# EAGLE design Ni-MH-charger-module (EAGLE 8.3.1)
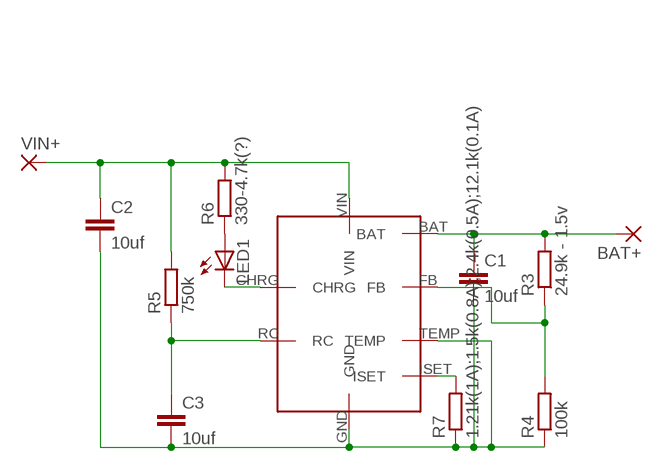
[diagram p0: schematic, sheet 1]

## Parts
BAT+  SMD5  [SMD2,54-5,08]
C1  10uf  C-EUC0805  [C0805]
C2  10uf  C-EUC0805  [C0805]
C3  10uf  C-EUC0805  [C0805]
LED1  LEDCHIPLED_0805  [CHIPLED_0805]
R3  24.9k - 1.5v  R-EU_R0805  [R0805]
R4  100k  R-EU_R0805  [R0805]
R5  750k  R-EU_R0805  [R0805]
R6  330-4.7k(?)  R-EU_R0805  [R0805]
R7  1.21k(1A);1.5k(0.8A);2.4k(0.5A);12.1k(0.1A)  R-EU_R0805  [R0805]
U$1  CN3085  [CN3085]
VIN+  SMD5  [SMD2,54-5,08]

## Nets
BAT+: BAT+.1(P) C1.1 R3.2 U$1.BAT
GND: C1.2 C2.2 C3.2 R4.1 R7.1 U$1.GND U$1.TEMP
N$3: R3.1 R4.2 U$1.FB
N$4: R7.2 U$1.ISET
N$5: C3.1 R5.1 U$1.RC
N$8: LED1.A R6.1
N$9: LED1.C U$1.CHRG
VIN: C2.1 R5.2 R6.2 U$1.VIN VIN+.1(P)

## Library data of the parts
BAT+ VIN+ = wirepad:SMD5: SMD PAD
C1-C3 = resistor:C-EU: CAPACITOR, European symbol
LED1 = adafruit:LED: LED OSRAM: - CHIPLED LG R971, LG N971, LY N971, LG Q971, LY Q971, LO R971, LY R971 LH N974, LH R974 LS Q976, LO Q976, LY Q976 LO Q996 - Hyper CHIPLED LW Q18S LB Q993, LB Q99A, LB R99A - SideLED LS A670, LO A670, LY A670, LG A670, LP A670 LB A673, LV A673, LT A673, LW A673 LH A674 LY A675 LS A676, LA A676, LO A676, LY A676, LW A676 LS A679, LY A679, LG A679 - Hyper Micro SIDELED® LS Y876, LA Y876, LO Y876, LY Y876 LT Y87S - SmartLED LW L88C, LW L88S LB L89C, LB L89S, LG L890 LS L89K, LO L89K, LY L89K LS L896, LA L896, LO L896, LY L896 - TOPLED LS T670, LO T670, LY T670, LG T670, LP T670 LSG T670, LSP T670, LSY T670, LOP T670, LYG T670 LG T671, LOG T671, LSG T671 LB T673, LV T673, LT T673, LW T673 LH T674 LS T676, LA T676, LO T676, LY T676, LB T676, LH T676, LSB T676, LW T676 LB T67C, LV T67C, LT T67C, LS T67K, LO T67K, LY T67K, LW E67C LS E67B, LA E67B, LO E67B, LY E67B, LB E67C, LV E67C, LT E67C LW T67C LS T679, LY T679, LG T679 LS T770, LO T770, LY T770, LG T770, LP T770 LB T773, LV T773, LT T773, LW T773 LH T774 LS E675, LA E675, LY E675, LS T675 LS T776, LA T776, LO T776, LY T776, LB T776 LHGB T686 LT T68C, LB T68C - Hyper Mini TOPLED® LB M676 - Mini TOPLED Santana® LG M470 LS M47K, LO M47K, LY M47K Source: http://www.osram.convergy.de/
R3-R7 = resistor:R-EU_: RESISTOR, European symbol
U$1 = mgvc:CN3085: 1A Nickel-Metal Hydride Battery Charger IC Контроллер заряда Ni-MH аккумуляторов. Максимальный ток до 1A.

## Board
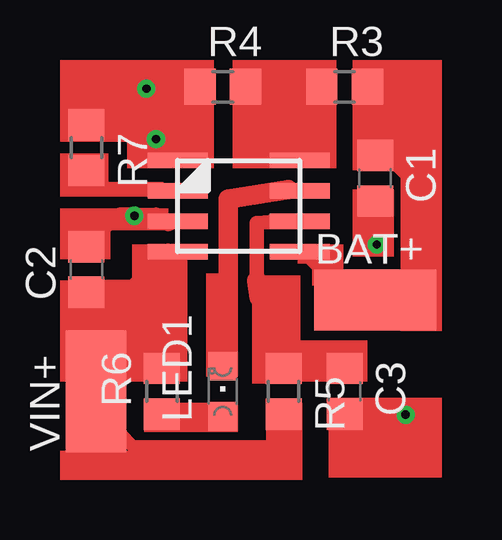
[diagram p1: board, top side]
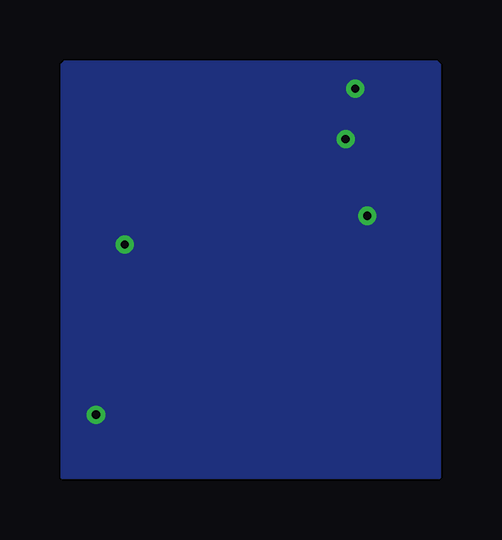
[diagram p2: board, bottom side, seen from below]

No outline drawn. Coordinates in mm, seen from the top.
Copper layers (1*16): Top 0.035mm / dielectric 1.5mm / Bottom 0.035mm
Design rules "default *": minimum track width 0.5mm, minimum drill 0.35mm, track to track 6mil, track to pad 6mil, pad to pad 6mil, via to via 6mil, smd to smd 6mil, copper to edge 40mil, drill to drill 6mil, minimum pad ring 10mil, minimum via ring 8mil, stop-mask expansion 4mil, vias tented up to drill 0mil, thermal gap 10mil

### Footprints (pad centres in the part's own frame; a part is rotated, then mirrored left to right if it is on the bottom)
SMD2,54-5,08 = smd 2.54 x 5.08: 1 0,0
C0805 = smd 1.3 x 1.5: 1 -0.95,0; 2 0.95,0
CHIPLED_0805 = smd 1.2 x 1.2: A 0,-1.05; C 0,1.05
R0805 = smd 1.3 x 1.5: 1 -0.95,0; 2 0.95,0
CN3085 = smd 2.5 x 0.635: BAT 5.08,0; CHRG 5.08,2.54; FB 5.08,3.81; GND 0,1.27; ISET 0,2.54; RC 5.08,1.27; TEMP 0,3.81; VIN 0,0

### Placement (x,y rotation side)
BAT+  24.13,8.89 270 top
C1  24.13,13.97 270 top
C2  12.1,10.16 90 top
C3  22.86,5.08 270 top
LED1  17.78,5.08 0 top
R3  22.86,17.78 0 top
R4  17.78,17.78 0 top
R5  20.32,5.08 270 top
R6  15.24,5.08 90 top
R7  12.1,15.24 270 top
U$1  15.9,10.9 0 top
VIN+  12.5,5.08 0 top

### Tracks (layer width: path | path; a pad name or v marks a point on that pad's centre or on a via)
BAT+
  Top 0.5: R3.2 24,17.5 24,15 C1.1 24.5,14.5 25,14.5 25.5,14 25.5,9 24.5,9 BAT+.1 24,9 23,9 21,11 U$1.BAT
GND  (via drill 0.35)
  Top 0.5: 14,12.5 13.5,12.5 12.5,11.5 C2.2 | R7.1 12.5,16.5 13.5,17.5 14.5,17.5 v14.6,17.7 14.5,18 16.5,18 R4.1 | C3.2 23,4 25.5,4 v25.4,4.1 | C1.2 24,13 24,11.5 v24.2,11.2 | 14,12.5 15,12.5 15.5,12 U$1.GND | 14,12.5 v14.1,12.4 | U$1.TEMP 15.5,15 15,15.5 v15,15.6
  pour Bottom: 11.1,1.6 11.1,18.7 11.2,18.8 26.7,18.8 26.8,18.7 26.8,1.5 11.1,1.5
N$3
  Top 0.5: 21,18 21.5,18 R3.1 | 21,18 19,18 R4.2 | 21,18 21,15 U$1.FB
N$4
  Top 0.5: R7.2 12.5,14 13,13.5 15.5,13.5 U$1.ISET
N$5
  Top 0.5: C3.1 22.5,6 20.5,6 R5.1 20,6.5 19.3,9.3 19.3,9 | 20.5,12.2 U$1.RC
  Top 0.61: 19.2,9.7 19.2,12.1 20.5,12.2
  Top 0.813: 19.2,9.7 19.3,9
N$8
  Top 0.5: LED1.A 17.5,4 15.5,4 R6.1
N$9
  Top 0.5: 18,6.5 LED1.C | 20.5,13.5 U$1.CHRG
  Top 0.813: 18,6.5 18,13.1 20.5,13.5
VIN
  Top 0.5: VIN+.1 12.5,6 | 12.5,6 12.5,9 C2.1 12.5,9.5 14,9.5 15.5,11 U$1.VIN | 12.5,6 15,6 R6.2 | 12.5,5.5 VIN+.1 | VIN+.1 12.5,4.5 14,2.8 19.9,2.8 20,4 R5.2
(copper drawn outside any net)
  shapes: Top area x23